# Altium schematic sheet Sheet1.SchDoc
size A4; SheetNumber: 1; SheetTotal: 1
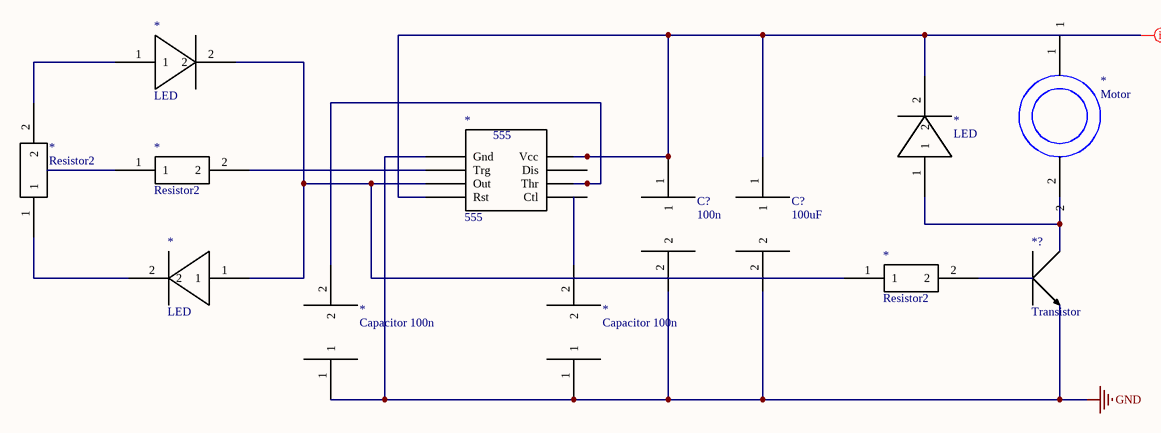
[diagram p0: Sheet1.SchDoc]

## Parts
(Parts that share a designator on the sheet are numbered #1, #2 ... from top to bottom, then left to right.)
*#1  LED  [Diode]
*#2  Motor  [Motor]
*#3  LED  [Diode]
*#4  Resistor2  [Resistor 1]
*#5  555  [555]
*#6  Resistor2  [Resistor 1]
*#7  LED  [Diode]
*#8  Resistor2  [Resistor 1]
*#9  Capacitor 100n  [Polarized Capacitor]
*#10  Capacitor 100n  [Polarized Capacitor]
*?  Transistor  [TRANSISTOR]
C?#1  100n  [Polarized Capacitor]
C?#2  100uF  [Polarized Capacitor]

## Nets
GND: *#5.?1(Gnd) *#9.1 *#10.1 C?#1.2 C?#2.2
Net*#1_1: *#1.1 *#4.2
Net*#1_2: *#1.2 *#5.?3(Out) *#7.1 *#8.1
Net*#3_2: *#3.2 *#5.?4(Rst) *#5.?5(Vcc) C?#1.1 C?#2.1
Net*#4_1: *#4.1 *#7.2
Net*#5_?2: *#5.?2(Trg) *#6.2
Net*#5_?7: *#5.?7(Thr) *#9.2

Not connected (* = marked no-connect by the designer): *#2 1 2; *#3 1; *#5 ?6(Dis) ?8(Ctl); *#6 1; *#8 2; *#10 2

## Layout directives
mark named 12v: Net*#3_2

## Library data of the parts
*#9 *#10 = Capacitor 1
C?#1 C?#2 = Capacitor